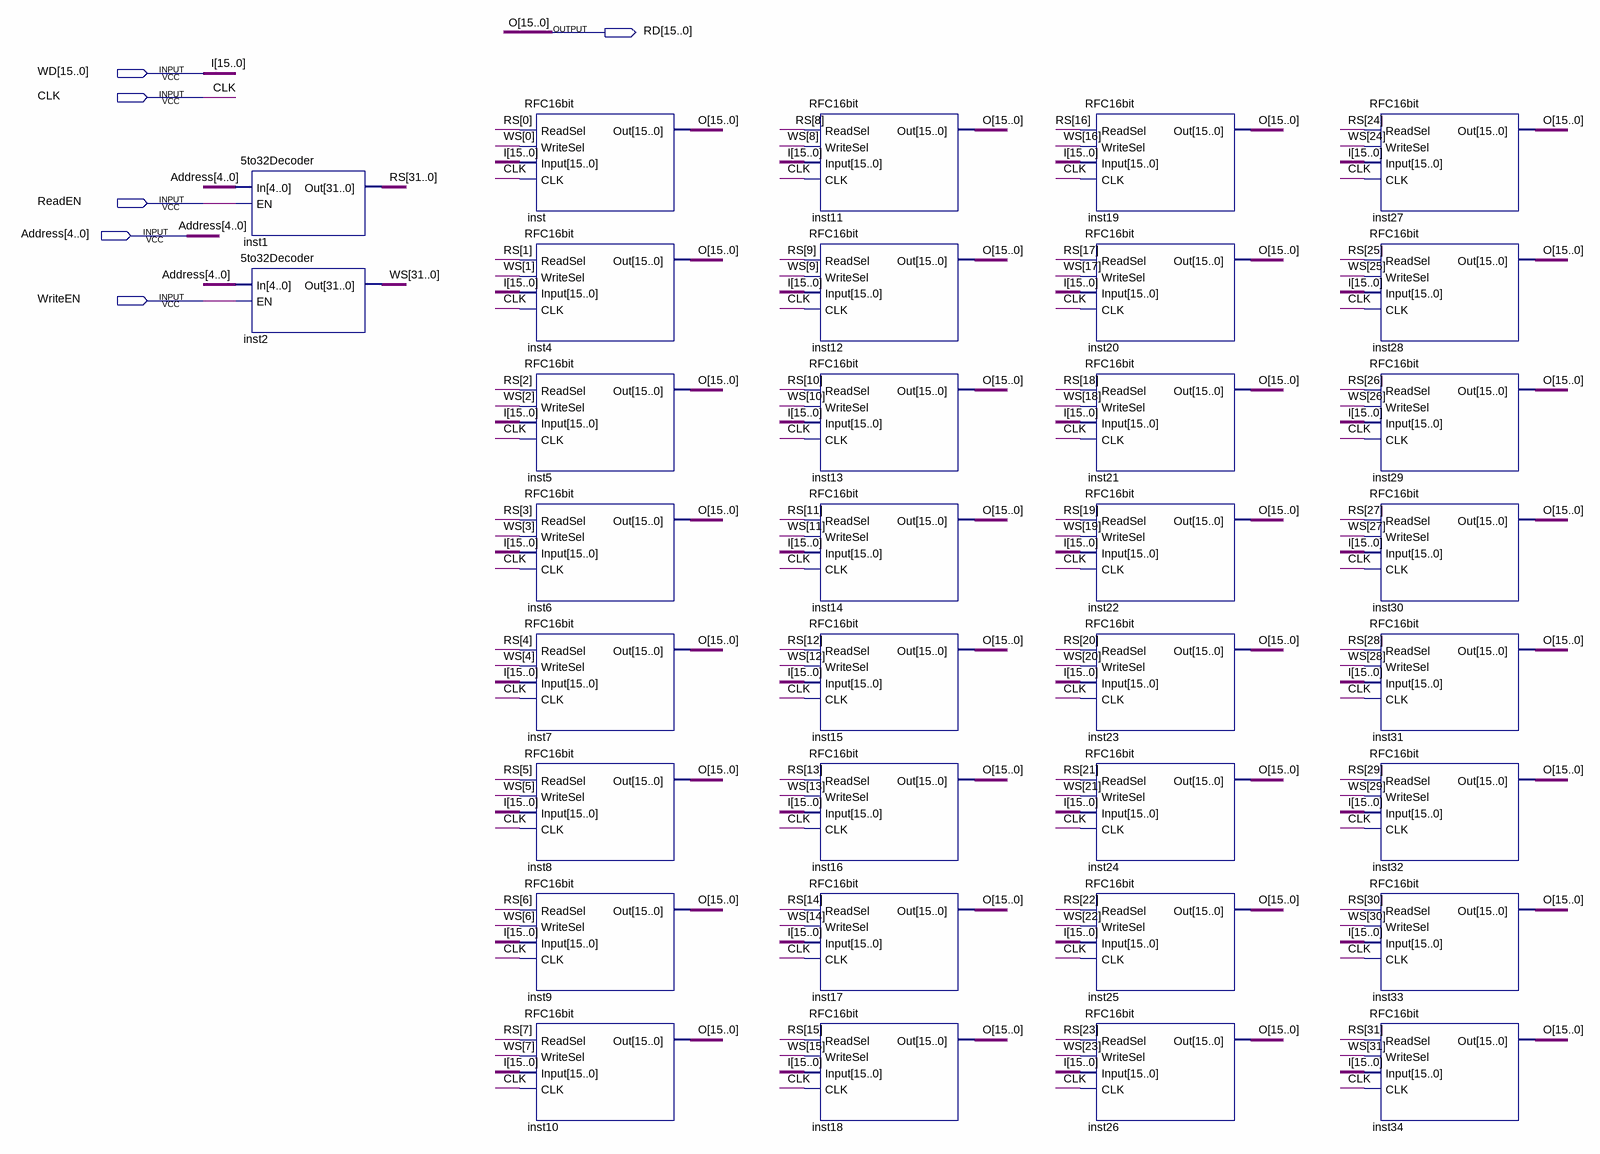
[diagram p0: schematic sheet]
// Quartus schematic Data_Mem_32x16.bdf as structural Verilog: 34 symbols, 6 pins
module Data_Mem_32x16 (
  input  [15:0] WD,
  input  CLK,
  input  ReadEN,
  input  [4:0] Address,
  input  WriteEN,
  output [15:0] RD
);

  wire [31:0] RS, WS;

  \5to32Decoder  inst1 (.In(Address), .EN(ReadEN), .Out(RS));
  \5to32Decoder  inst2 (.In(Address), .EN(WriteEN), .Out(WS));
  RFC16bit inst (.ReadSel(RS[0]), .WriteSel(WS[0]), .Input(WD), .CLK(CLK), .Out(RD));
  RFC16bit inst4 (.ReadSel(RS[1]), .WriteSel(WS[1]), .Input(WD), .CLK(CLK), .Out(RD));
  RFC16bit inst5 (.ReadSel(RS[2]), .WriteSel(WS[2]), .Input(WD), .CLK(CLK), .Out(RD));
  RFC16bit inst6 (.ReadSel(RS[3]), .WriteSel(WS[3]), .Input(WD), .CLK(CLK), .Out(RD));
  RFC16bit inst7 (.ReadSel(RS[4]), .WriteSel(WS[4]), .Input(WD), .CLK(CLK), .Out(RD));
  RFC16bit inst8 (.ReadSel(RS[5]), .WriteSel(WS[5]), .Input(WD), .CLK(CLK), .Out(RD));
  RFC16bit inst9 (.ReadSel(RS[6]), .WriteSel(WS[6]), .Input(WD), .CLK(CLK), .Out(RD));
  RFC16bit inst10 (.ReadSel(RS[7]), .WriteSel(WS[7]), .Input(WD), .CLK(CLK), .Out(RD));
  RFC16bit inst11 (.ReadSel(RS[8]), .WriteSel(WS[8]), .Input(WD), .CLK(CLK), .Out(RD));
  RFC16bit inst12 (.ReadSel(RS[9]), .WriteSel(WS[9]), .Input(WD), .CLK(CLK), .Out(RD));
  RFC16bit inst13 (.ReadSel(RS[10]), .WriteSel(WS[10]), .Input(WD), .CLK(CLK), .Out(RD));
  RFC16bit inst14 (.ReadSel(RS[11]), .WriteSel(WS[11]), .Input(WD), .CLK(CLK), .Out(RD));
  RFC16bit inst15 (.ReadSel(RS[12]), .WriteSel(WS[12]), .Input(WD), .CLK(CLK), .Out(RD));
  RFC16bit inst16 (.ReadSel(RS[13]), .WriteSel(WS[13]), .Input(WD), .CLK(CLK), .Out(RD));
  RFC16bit inst17 (.ReadSel(RS[14]), .WriteSel(WS[14]), .Input(WD), .CLK(CLK), .Out(RD));
  RFC16bit inst18 (.ReadSel(RS[15]), .WriteSel(WS[15]), .Input(WD), .CLK(CLK), .Out(RD));
  RFC16bit inst19 (.ReadSel(RS[16]), .WriteSel(WS[16]), .Input(WD), .CLK(CLK), .Out(RD));
  RFC16bit inst20 (.ReadSel(RS[17]), .WriteSel(WS[17]), .Input(WD), .CLK(CLK), .Out(RD));
  RFC16bit inst21 (.ReadSel(RS[18]), .WriteSel(WS[18]), .Input(WD), .CLK(CLK), .Out(RD));
  RFC16bit inst22 (.ReadSel(RS[19]), .WriteSel(WS[19]), .Input(WD), .CLK(CLK), .Out(RD));
  RFC16bit inst23 (.ReadSel(RS[20]), .WriteSel(WS[20]), .Input(WD), .CLK(CLK), .Out(RD));
  RFC16bit inst24 (.ReadSel(RS[21]), .WriteSel(WS[21]), .Input(WD), .CLK(CLK), .Out(RD));
  RFC16bit inst25 (.ReadSel(RS[22]), .WriteSel(WS[22]), .Input(WD), .CLK(CLK), .Out(RD));
  RFC16bit inst26 (.ReadSel(RS[23]), .WriteSel(WS[23]), .Input(WD), .CLK(CLK), .Out(RD));
  RFC16bit inst27 (.ReadSel(RS[24]), .WriteSel(WS[24]), .Input(WD), .CLK(CLK), .Out(RD));
  RFC16bit inst28 (.ReadSel(RS[25]), .WriteSel(WS[25]), .Input(WD), .CLK(CLK), .Out(RD));
  RFC16bit inst29 (.ReadSel(RS[26]), .WriteSel(WS[26]), .Input(WD), .CLK(CLK), .Out(RD));
  RFC16bit inst30 (.ReadSel(RS[27]), .WriteSel(WS[27]), .Input(WD), .CLK(CLK), .Out(RD));
  RFC16bit inst31 (.ReadSel(RS[28]), .WriteSel(WS[28]), .Input(WD), .CLK(CLK), .Out(RD));
  RFC16bit inst32 (.ReadSel(RS[29]), .WriteSel(WS[29]), .Input(WD), .CLK(CLK), .Out(RD));
  RFC16bit inst33 (.ReadSel(RS[30]), .WriteSel(WS[30]), .Input(WD), .CLK(CLK), .Out(RD));
  RFC16bit inst34 (.ReadSel(RS[31]), .WriteSel(WS[31]), .Input(WD), .CLK(CLK), .Out(RD));

  // Other names for the same wires on the sheet: I[15:0] = WD; O[15:0] = RD
endmodule
